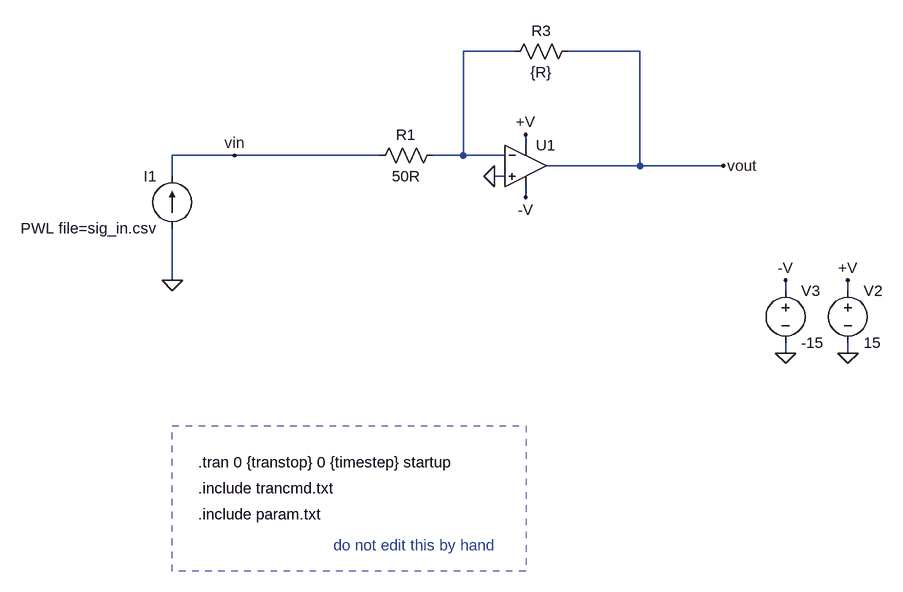
[diagram p0: schematic op_ampt.asc]
op_ampt.asc, the LTspice schematic file:
Version 4
SHEET 1 1800 852
WIRE 736 -64 656 -64
WIRE 928 -64 816 -64
WIRE 752 80 752 64
WIRE 304 96 208 96
WIRE 528 96 304 96
WIRE 656 96 656 -64
WIRE 656 96 608 96
WIRE 720 96 656 96
WIRE 928 112 928 -64
WIRE 928 112 784 112
WIRE 1056 112 928 112
WIRE 208 128 208 96
WIRE 720 128 704 128
WIRE 752 160 752 144
WIRE 208 288 208 208
WIRE 1152 304 1152 288
WIRE 1248 304 1248 288
WIRE 1152 400 1152 384
WIRE 1248 400 1248 384
FLAG 304 96 vin
FLAG 208 288 0
FLAG 1056 112 vout
FLAG 1248 400 0
FLAG 1248 288 +V
FLAG 1152 400 0
FLAG 1152 288 -V
FLAG 752 64 +V
FLAG 752 160 -V
FLAG 704 128 0
SYMBOL res 624 80 R90
WINDOW 0 0 56 VBottom 2
WINDOW 3 32 56 VTop 2
SYMATTR InstName R1
SYMATTR Value 50R
SYMBOL voltage 1248 288 R0
SYMATTR InstName V2
SYMATTR Value 15
SYMBOL voltage 1152 288 R0
SYMATTR InstName V3
SYMATTR Value -15
SYMBOL res 832 -80 R90
WINDOW 0 0 56 VBottom 2
WINDOW 3 32 56 VTop 2
SYMATTR InstName R3
SYMATTR Value {R}
SYMBOL current 208 208 R180
WINDOW 0 24 80 Left 2
WINDOW 3 24 0 Left 2
WINDOW 123 0 0 Left 0
WINDOW 39 0 0 Left 0
SYMATTR InstName I1
SYMATTR Value PWL file=sig_in.csv
SYMBOL OpAmps\\UniversalOpAmp1 752 112 R0
SYMATTR InstName U1
SYMATTR Value2 Avol=1Meg GBW=10000Meg Vos=0
TEXT 248 568 Left 2 !.tran 0 {transtop} 0 {timestep} startup
TEXT 248 648 Left 2 !.include param.txt
TEXT 248 608 Left 2 !.include trancmd.txt
TEXT 456 696 Left 2 ;do not edit this by hand
RECTANGLE Normal 752 736 208 512 2

The netlist it stands for:
* op_ampt.asc
R1 N001 vin 50R
V2 +V 0 15
V3 -V 0 -15
R3 vout N001 {R}
I1 0 vin PWL file=sig_in.csv
XU1 0 N001 +V -V vout level1 Avol=1Meg GBW=10000Meg Vos=0 En=0 Enk=0 In=0 Ink=0 Rin=500Meg  ; pins In+ In- V+ V- OUT
.tran 0 {transtop} 0 {timestep} startup
.include param.txt
.include trancmd.txt
* do not edit this by hand
.lib UniversalOpAmp1.lib
.backanno
.end